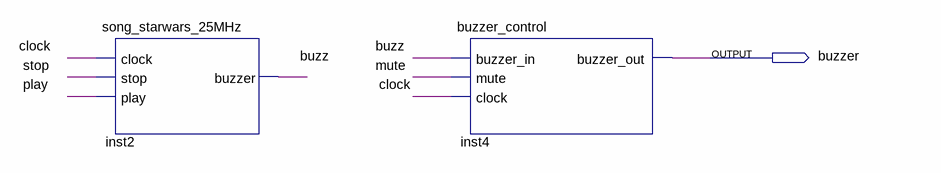
[diagram p0: schematic sheet]
// Quartus schematic buzzer_bloco.bdf as structural Verilog: 2 symbols, 1 pins
module buzzer_bloco (
  output buzzer
);

  wire buzz, clock, mute, play, stop;

  song_starwars_25MHz inst2 (.clock(clock), .play(play), .stop(stop), .buzzer(buzz));
  buzzer_control inst4 (.buzzer_in(buzz), .mute(mute), .clock(clock), .buzzer_out(buzzer));
endmodule
